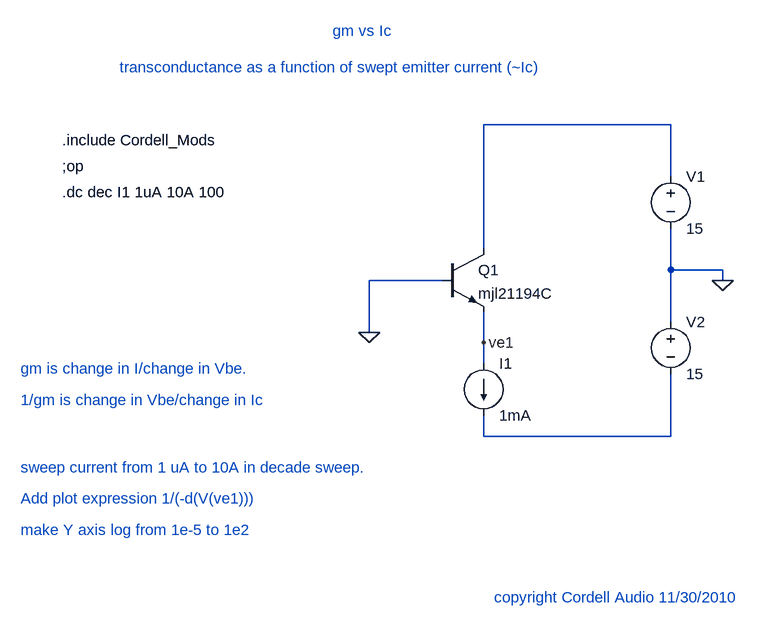
[diagram p0: schematic gm vs Ic.asc]
gm vs Ic.asc, the LTspice schematic file:
Version 4
SHEET 1 880 808
WIRE 288 64 0 64
WIRE 288 144 288 64
WIRE 0 256 0 64
WIRE 288 288 288 224
WIRE 368 288 288 288
WIRE -64 304 -176 304
WIRE 368 304 368 288
WIRE 288 368 288 288
WIRE -176 384 -176 304
WIRE 0 400 0 352
WIRE 0 432 0 400
WIRE 0 544 0 512
WIRE 288 544 288 448
WIRE 288 544 0 544
FLAG 368 304 0
FLAG -176 384 0
FLAG 0 400 ve1
SYMBOL voltage 288 128 R0
WINDOW 123 0 0 Left 0
WINDOW 39 0 0 Left 0
SYMATTR InstName V1
SYMATTR Value 15
SYMBOL npn -64 256 R0
SYMATTR InstName Q1
SYMATTR Value mjl21194C
SYMBOL current 0 432 R0
WINDOW 123 0 0 Left 0
WINDOW 39 0 0 Left 0
SYMATTR InstName I1
SYMATTR Value 1mA
SYMBOL voltage 288 352 R0
WINDOW 123 0 0 Left 0
WINDOW 39 0 0 Left 0
SYMATTR InstName V2
SYMATTR Value 15
TEXT -648 128 Left 0 !;op
TEXT -232 -80 Left 0 ;gm vs Ic
TEXT -648 168 Left 0 !.dc dec I1 1uA 10A 100
TEXT -712 640 Left 0 ;Add plot expression 1/(-d(V(ve1)))
TEXT -712 440 Left 0 ;gm is change in I/change in Vbe.
TEXT -712 488 Left 0 ;1/gm is change in Vbe/change in Ic
TEXT -712 592 Left 0 ;sweep current from 1 uA to 10A in decade sweep.
TEXT -712 688 Left 0 ;make Y axis log from 1e-5 to 1e2
TEXT -648 88 Left 0 !.include Cordell_Mods
TEXT -560 -24 Left 0 ;transconductance as a function of swept emitter current (~Ic)
TEXT 16 792 Left 0 ;copyright Cordell Audio 11/30/2010

The netlist it stands for:
* gm vs Ic.asc
V1 N001 0 15
Q1 N001 0 ve1 0 mjl21194C
I1 ve1 N002 1mA
V2 0 N002 15
.model NPN NPN
.model PNP PNP
.lib standard.bjt
;op
* gm vs Ic
.dc dec I1 1uA 10A 100
* Add plot expression 1/(-d(V(ve1)))
* gm is change in I/change in Vbe.
* 1/gm is change in Vbe/change in Ic
* sweep current from 1 uA to 10A in decade sweep.
* make Y axis log from 1e-5 to 1e2
.include Cordell_Mods
* transconductance as a function of swept emitter current (~Ic)
* copyright Cordell Audio 11/30/2010
.backanno
.end